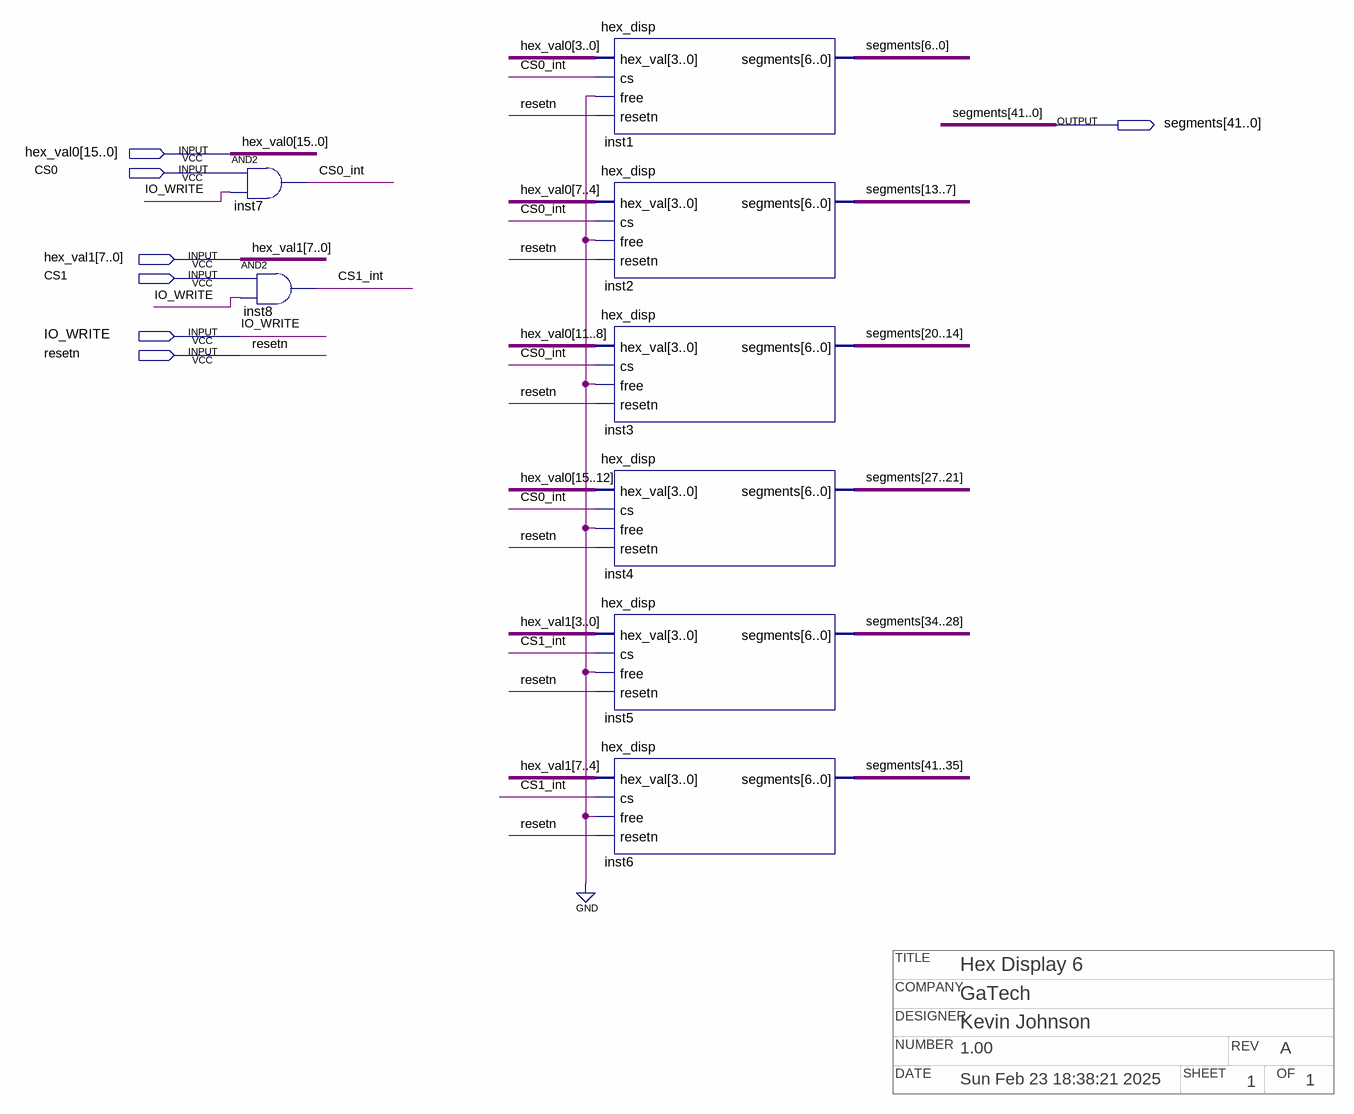
[diagram p0: schematic sheet]
// Quartus schematic HEX_DISP_6.bdf as structural Verilog: 8 symbols, 7 pins
// Title block: COMPANY: GaTech; DATE: Sun Feb 23 18:38:21 2025; DESIGNER: Kevin Johnson; NUMBER: 1.00; OF: 1; REV: A; SHEET: 1; TITLE: Hex Display 6
module HEX_DISP_6 (
  input  [15:0] hex_val0,
  input  CS0,
  input  [7:0] hex_val1,
  input  CS1,
  input  IO_WRITE,
  input  resetn,
  output [41:0] segments
);

  wire CS0_int, CS1_int;

  and inst7 (CS0_int, CS0, IO_WRITE);
  and inst8 (CS1_int, CS1, IO_WRITE);
  hex_disp inst1 (.hex_val(hex_val0[3:0]), .cs(CS0_int), .free(1'b0), .resetn(resetn), .segments(segments[6:0]));
  hex_disp inst2 (.hex_val(hex_val0[7:4]), .cs(CS0_int), .free(1'b0), .resetn(resetn), .segments(segments[13:7]));
  hex_disp inst3 (.hex_val(hex_val0[11:8]), .cs(CS0_int), .free(1'b0), .resetn(resetn), .segments(segments[20:14]));
  hex_disp inst4 (.hex_val(hex_val0[15:12]), .cs(CS0_int), .free(1'b0), .resetn(resetn), .segments(segments[27:21]));
  hex_disp inst5 (.hex_val(hex_val1[3:0]), .cs(CS1_int), .free(1'b0), .resetn(resetn), .segments(segments[34:28]));
  hex_disp inst6 (.hex_val(hex_val1[7:4]), .cs(CS1_int), .free(1'b0), .resetn(resetn), .segments(segments[41:35]));
endmodule
